# EAGLE design overdriver (EAGLE 7.6.0)
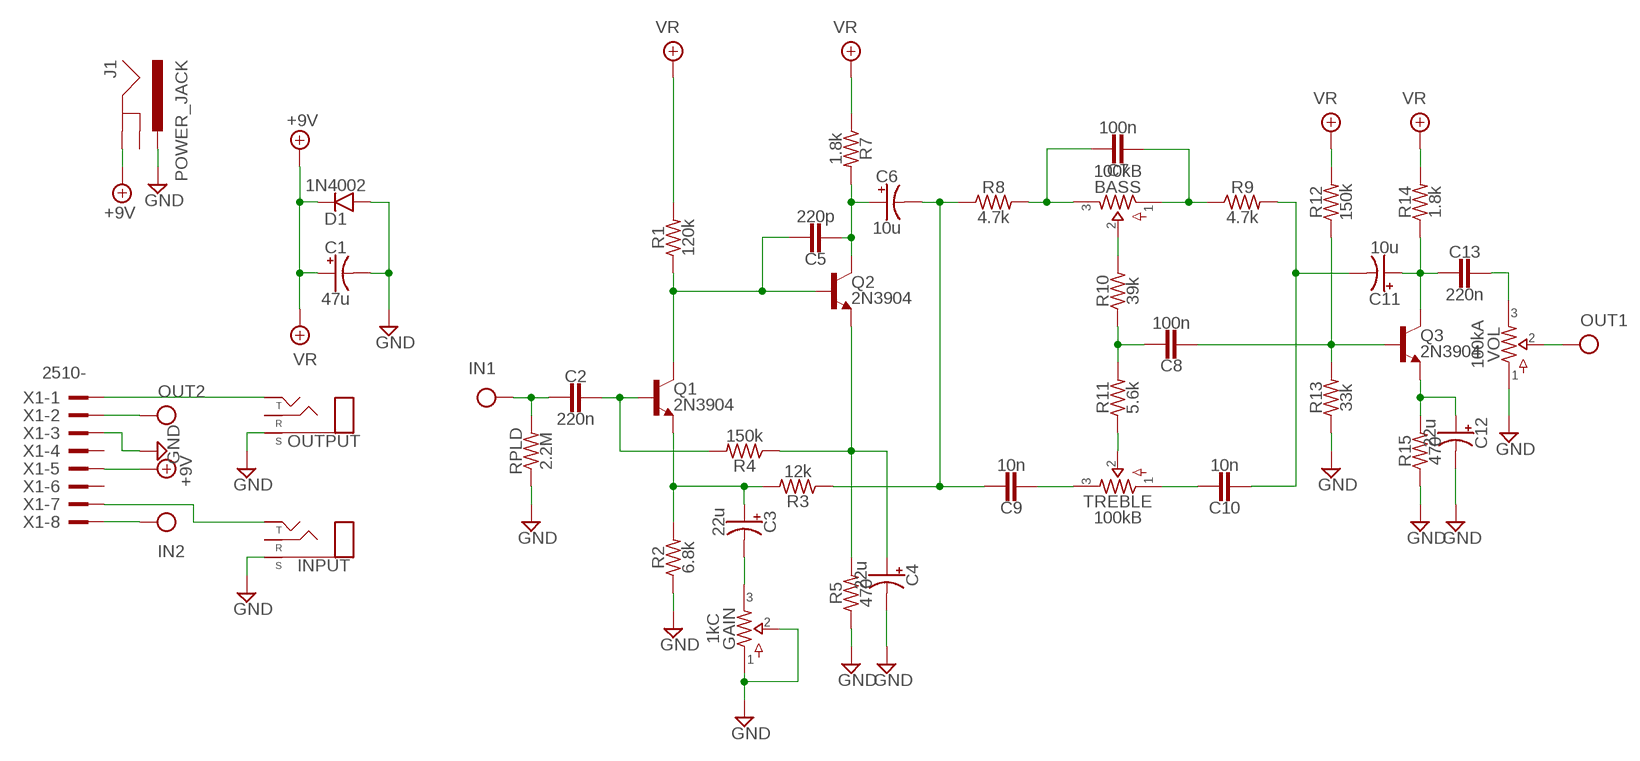
[diagram p0: schematic, sheet 1]

## Parts
BASS  100kB  POTS16MM  [16MM]
C1  47u  0400  [040_020]
C2  220n  CER/FILMBOX.1  [BOX_SMALL]
C3  22u  0400  [040_020]
C4  22u  0400  [040_020]
C5  220p  CER/FILM2  [050X030_025_2]
C6  10u  0501  [050_020_1]
C7  100n  CER/FILMBOX.1  [BOX_SMALL]
C8  100n  CER/FILMBOX.1  [BOX_SMALL]
C9  10n  CER/FILMBOX.1  [BOX_SMALL]
C10  10n  CER/FILMBOX.1  [BOX_SMALL]
C11  10u  0501  [050_020_1]
C12  22u  0400  [040_020]
C13  220n  CER/FILMBOX.1  [BOX_SMALL]
D1  1N4002  DO41.2  [DO41-2]
GAIN  1kC  POTS16MM  [16MM]
INPUT  STEREONMJ  [NMJ6HCD2]
J1  POWER_JACK  [POWER_JACK_PTH]
OUTPUT  STEREONMJ  [NMJ6HCD2]
Q1  2N3904  [TO92-]
Q2  2N3904  [TO92-]
Q3  2N3904  [TO92-]
R1  120k  R_.3B  [R0207/3]
R2  6.8k  R_.3B  [R0207/3]
R3  12k  R_.3B  [R0207/3]
R4  150k  R_.3B  [R0207/3]
R5  470  R_.3B  [R0207/3]
R7  1.8k  R_.3B  [R0207/3]
R8  4.7k  R_.3B  [R0207/3]
R9  4.7k  R_.3B  [R0207/3]
R10  39k  R_.3B  [R0207/3]
R11  5.6k  R_.3B  [R0207/3]
R12  150k  R_.3B  [R0207/3]
R13  33k  R_.3B  [R0207/3]
R14  1.8k  R_.3B  [R0207/3]
R15  470  R_.3B  [R0207/3]
RPLD  2.2M  R_.3B  [R0207/3]
TREBLE  100kB  POTS16MM  [16MM]
VOL  100kA  POTS16MM  [16MM]
X1  2510-  [PAK100/2500-10]

## Nets
+9V: C1.+ D1.C J1.GND X1.5 ; supply symbol labelled VR
GND: C1.- C4.- C12.- D1.A GAIN.1 GAIN.2 INPUT.S J1.PWR OUTPUT.S R2.1 R5.1 R13.1 R15.1 RPLD.1 VOL.1 X1.3
IN: C2.2 RPLD.2 X1.8
N$1: INPUT.T X1.7
N$4: OUTPUT.T X1.1
N$6: C5.1 Q1.1(C) Q2.2(B) R1.1
N$7: C2.1 Q1.2(B) R4.2
N$8: C3.+ Q1.3(E) R2.2 R3.2
N$9: C3.- GAIN.3
N$10: C5.2 C6.+ Q2.1(C) R7.2
N$11: C6.- C9.1 R3.1 R8.1
N$12: C4.+ Q2.3(E) R4.1 R5.2
N$14: BASS.3 C7.1 R8.2
N$15: BASS.1 C7.2 R9.1
N$16: BASS.2 R10.2
N$17: R11.1 TREBLE.2
N$18: C8.1 R10.1 R11.2
N$19: C9.2 TREBLE.3
N$20: C10.1 TREBLE.1
N$21: C10.2 C11.- R9.2
N$22: C8.2 Q3.2(B) R12.1 R13.2
N$23: C11.+ C13.2 Q3.1(C) R14.1
N$24: C12.+ Q3.3(E) R15.2
N$25: C13.1 VOL.3
OUT: VOL.2 X1.2
VR: R1.2 R7.1 R12.2 R14.2
Unconnected: INPUT.R J1.GNDBREAK OUTPUT.R X1.4 X1.6

## Library data of the parts
BASS GAIN TREBLE VOL = pedals-potentiometers:POTS
C1 C3 C4 C12 = pedals-capacitors-elec:040
C2 C5 C7-C10 C13 = pedals-capacitors-film:CER/FILM: 47 - 120pF Xicon Ceramic Disc 2.5mm lead spacing
C6 C11 = pedals-capacitors-elec:050
D1 = pedals-diodes:DO41: DO-41 Package Diodes: 1N4001 - 1N40019 Zener Diodes: 1N4728 - 1N4764
INPUT OUTPUT = pedals-jacks:STEREO
J1 = pedals-jacks:POWER_JACK: Power Jack Connector This is the standard 5.5mm barrel jack for power. The PTH is the most common, proven, reliable, footprint. The Slot footprint only works if the mill layer is transmitted to the PCB fab house so be warned. Here are the connectors we sell at SparkFun: DC Barrel Power Jack/Connector <https://www.sparkfun.com/products/119> (PRT-00119) DC Barrel Power Jack/Connector (SMD) <https://www.sparkfun.com/products/12748> (PRT-12748) DC Barrel Jack Adapter - Breadboard Compatible <https://www.sparkfun.com/products/10811> (PRT-10811) It is used on this SparkFun product (and many, many others): SparkFun RedBoard - Programmed with Arduino <https://www.sparkfun.com/products/12757> (DEV-12757) Also, if you need a mating power supply or connector, please check these out: Wall Adapter Power Supply - 9VDC 650mA <https://www.sparkfun.com/products/298> (TOL-00298) DC Barrel Jack Adapter - Male <https://www.sparkfun.com/products/10287> (PRT-10287); PROD_ID: CONN-08197
Q1-Q3 = pedals-transistors:2N3904: NPN Transistor
R1-R5 R7-R15 RPLD = pedals-resistors:R_
X1 = pedals-headers:2510-: 3M (TM) Pak 100 4-Wall Header Source: 3M; MF: 3M; MPN: 2510-6002UB; OC_FARNELL: 9838244; OC_NEWARK: 46F4725

## Board
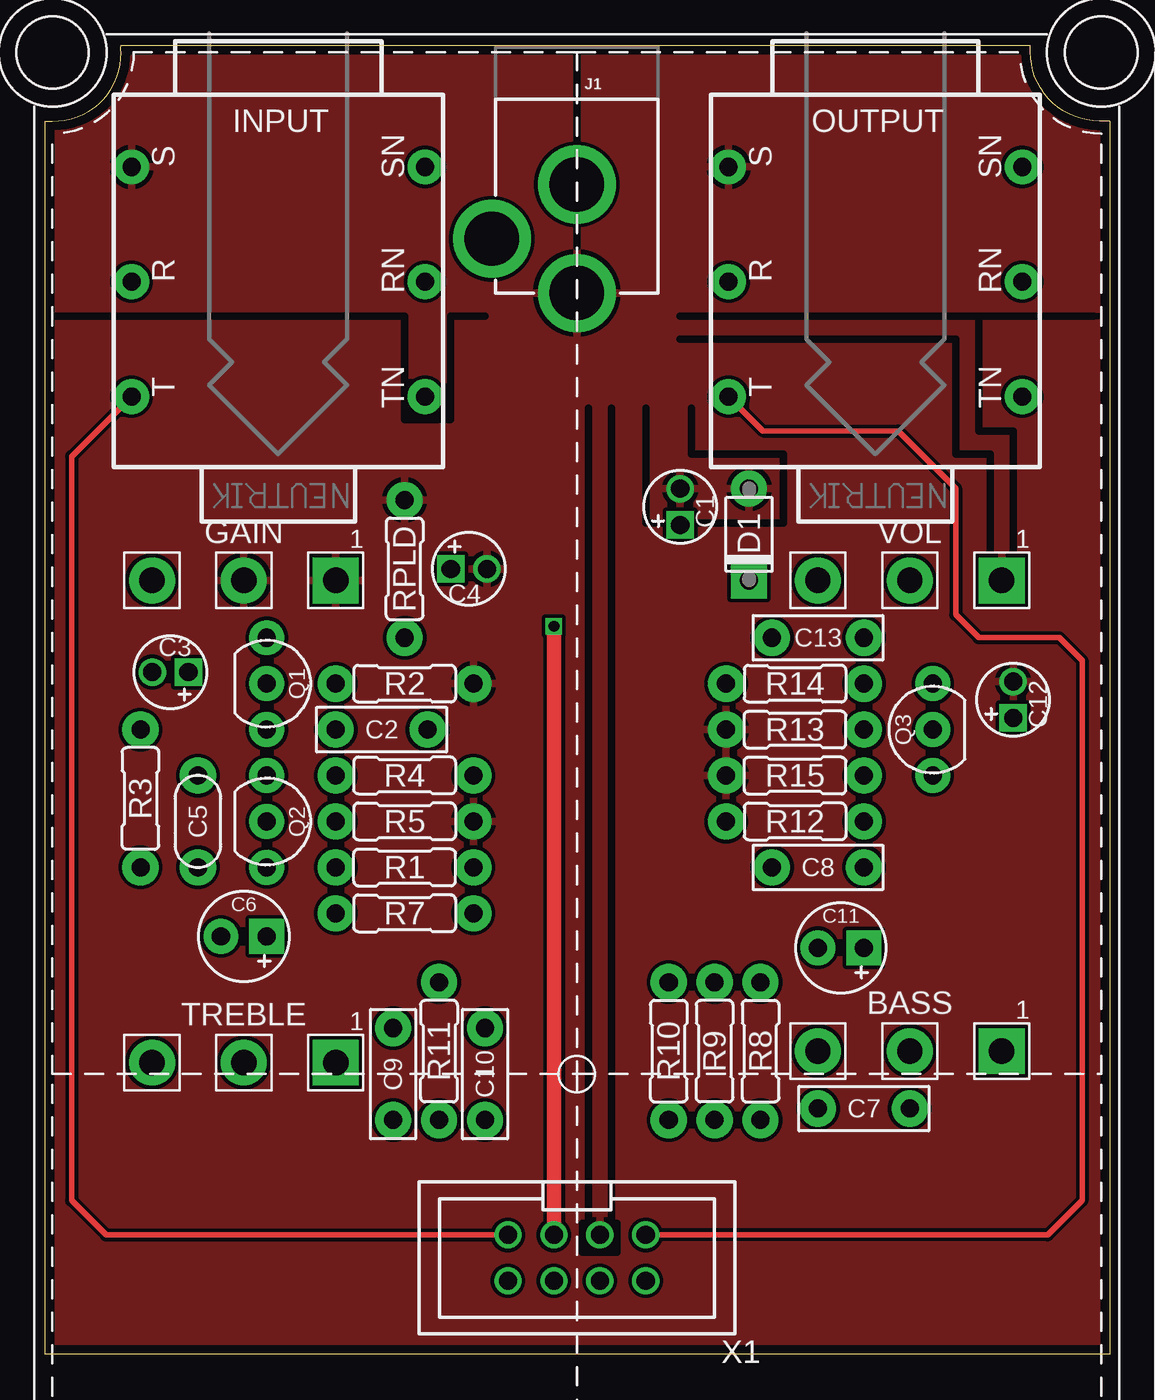
[diagram p1: board, top side]
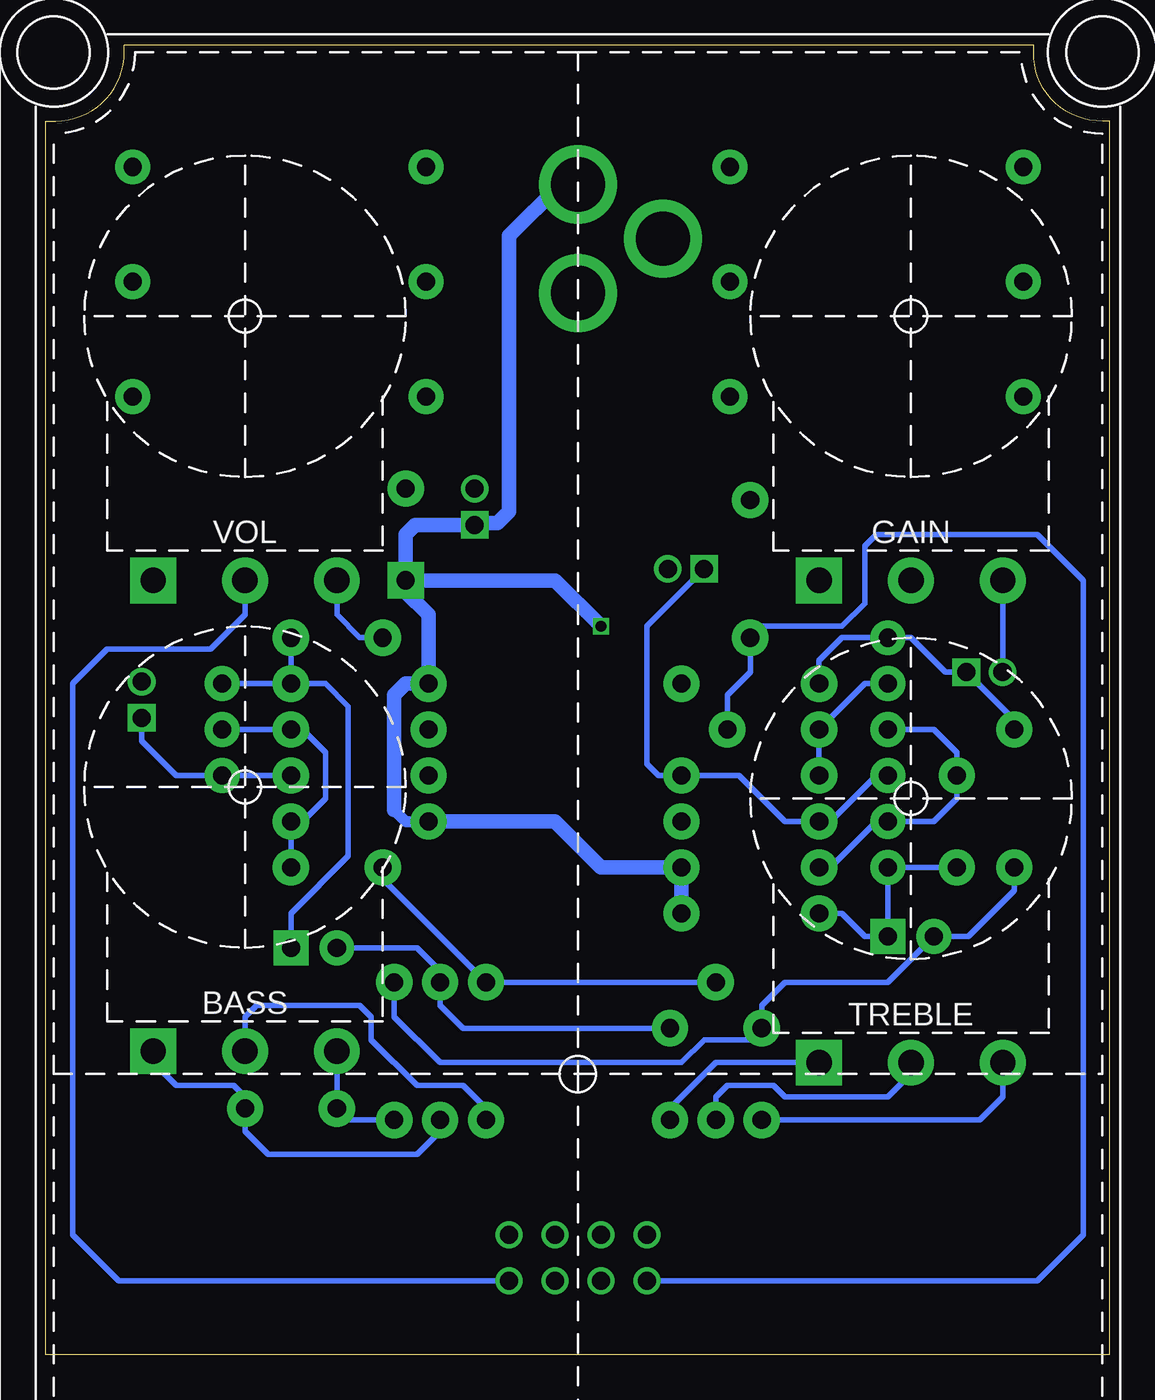
[diagram p2: board, bottom side, seen from below]

Size 58.86 x 72.39 mm. Coordinates in mm from the lower left corner, seen from the top.
Outline: 4.19,72.39 54.48,72.39 54.48,72.01 arc90 58.29,68.2 58.86,68.2 58.86,0 0,0 0,68.2 0.38,68.2 arc93 4.19,72.01 arc-7 4.19,72.39
Copper layers (1*16): Top 0.035mm / dielectric 1.6mm / Bottom 0.035mm
Design rules "Elecrow_2-layer_PCB_eagle_rule": minimum track width 6mil, minimum drill 12mil, track to track 6mil, track to pad 6mil, pad to pad 6mil, via to via 8mil, smd to smd 0mil, copper to edge 20mil, drill to drill 10mil, minimum pad ring 6mil, minimum via ring 6mil, stop-mask expansion 0mil, vias tented up to drill 100mil, thermal gap 10mil
tRestrict: 32 lines

### Footprints (pad centres in the part's own frame; a part is rotated, then mirrored left to right if it is on the bottom)
16MM = drill 1.4 pad 2.54 square: 1 5.08,0 | drill 1.4 pad 2.54: 2 0,0; 3 -5.08,0
040_020 = drill 1 pad 1.524 square: + -1.001,0 | drill 1 pad 1.524: - 1.001,0
BOX_SMALL = drill 1 pad 2: 1 -2.54,0; 2 2.54,0
050X030_025_2 = drill 1 pad 2: 1 -2.54,0; 2 2.54,0
050_020_1 = drill 1 pad 1.93 square: + -1.27,0 | drill 1 pad 1.93: - 1.27,0
DO41-2 = drill 1 pad 2: A 2.54,0 | drill 1 pad 2 square: C -2.54,0
NMJ6HCD2 = drill 1 pad 1.93: R 0,8.115; RN 0,-8.115; S 6.35,8.115; SN 6.35,-8.115; T -6.35,8.115; TN -6.35,-8.115
POWER_JACK_PTH = drill 2.997 pad 4.318: GND 0,7.7; GNDBREAK 4.7,10.7; PWR 0,13.7
TO92- = drill 1 pad 1.93: 1 2.54,0; 2 0,0; 3 -2.54,0
R0207/3 = drill 1 pad 2: 1 -3.81,0; 2 3.81,0
PAK100/2500-10 = drill 1 pad 1.422: 1 -3.81,-1.27; 2 -3.81,1.27; 3 -1.27,-1.27; 4 -1.27,1.27; 5 1.27,-1.27; 6 1.27,1.27; 7 3.81,-1.27; 8 3.81,1.27

### Placement (x,y rotation side)
BASS  47.82,16.76 0 top
C1  35.12,46.86 90 top
C2  18.61,34.54 0 top
C3  6.92,37.72 180 top
C4  23.43,43.43 0 top
C5  8.45,29.46 270 top
C6  10.99,23.11 180 top
C7  45.28,13.59 0 top
C8  42.74,26.92 0 top
C9  19.24,15.49 270 top
C10  24.32,15.49 90 top
C11  44.01,22.48 180 top
C12  53.53,36.2 90 top
C13  42.74,39.62 0 top
D1  38.93,45.34 90 top
GAIN  10.99,42.8 0 top
INPUT  12.89,59.31 90 top
J1  29.4,72.39 180 top
OUTPUT  45.91,59.31 90 top
Q1  12.26,37.08 270 top
Q2  12.26,29.46 270 top
Q3  49.09,34.54 90 top
R1  19.88,26.92 0 top
R2  19.88,37.08 180 top
R3  5.27,30.73 90 top
R4  19.88,32 180 top
R5  19.88,29.46 180 top
R7  19.88,24.38 180 top
R8  39.56,16.76 270 top
R9  37.02,16.76 90 top
R10  34.48,16.76 270 top
R11  21.78,16.76 90 top
R12  41.47,29.46 180 top
R13  41.47,34.54 0 top
R14  41.47,37.08 180 top
R15  41.47,32 0 top
RPLD  19.88,43.43 270 top
TREBLE  10.99,16.13 0 top
U$1  [125B]  29.4,15.49 0 top
VOL  47.82,42.8 0 top
X1  29.4,5.33 180 top

### Tracks (layer width: path | path; a pad name or v marks a point on that pad's centre or on a via)
+9V  (via drill 0.6)
  Top 0.813: v28.13,40.26 X1.5
  Bottom 0.813: J1.GND 30.37,64.69 33.21,61.85 33.21,46.61 33.85,45.97 35,45.97 C1.+ 38.4,45.86 38.93,45.34 D1.C 30.67,42.8 v28.13,40.26
GND
  pour Top (isolate 0.203): 0.19,72.64 59.25,72.64 58.61,0.25 0.19,0.25
IN
  Bottom 0.305: C2.2 21.15,36.45 19.88,37.72 RPLD.2 19.24,40.26 14.8,40.26 13.53,41.53 13.53,44.7 12.89,45.34 4,45.34 1.46,42.8 1.46,6.6 4,4.06 X1.8
N$1
  Top 0.305: INPUT.T 1.46,49.64 1.46,8.51 3.37,6.6 X1.7
N$4
  Top 0.305: OUTPUT.T 39.7,51.05 47.18,51.05 50.36,47.88 50.36,40.89 51.63,39.62 56.07,39.62 57.34,38.35 57.34,8.51 55.44,6.6 X1.1
N$6
  Bottom 0.305: Q1.1 9.72,34.54 8.45,33.27 C5.1 8.45,30.73 9.72,29.46 Q2.2 12.89,29.46 15.43,26.92 R1.1
N$7
  Bottom 0.305: Q1.2 13.53,37.08 C2.1 R4.2
N$8
  Bottom 0.305: R3.2 5.27,35.07 C3.+ 9.08,37.72 10.99,39.62 Q1.3 14.8,39.62 16.07,38.35 R2.2
N$9
  Bottom 0.305: GAIN.3 5.91,37.73 C3.-
N$10
  Bottom 0.305: C5.2 Q2.1 C6.+ 13.53,23.11 14.8,24.38 R7.2
N$11
  Bottom 0.305: R3.1 5.27,25.65 7.81,23.11 C6.- 12.26,20.57 17.97,20.57 19.24,19.3 C9.1 19.88,17.4 22.42,17.4 23.69,16.13 37.02,16.13 39.56,18.67 R8.1
N$12
  Bottom 0.305: Q2.3 12.89,32 15.43,29.46 R5.2 17.97,29.46 20.51,32 R4.1 24.96,32 25.59,32.64 25.59,40.26 22.43,43.42 C4.+
N$14
  Bottom 0.305: R8.2 42.1,12.95 C7.1 BASS.3
N$15
  Bottom 0.305: R9.1 37.02,12.32 38.29,11.05 46.55,11.05 47.82,12.32 C7.2 47.82,14.22 48.45,14.86 51.63,14.86 52.9,16.13 BASS.1
N$16
  Bottom 0.305: R10.2 34.48,13.59 35.75,14.86 38.29,14.86 40.83,17.4 40.83,18.67 41.47,19.3 47.18,19.3 47.82,18.67 BASS.2
N$17
  Bottom 0.305: R11.1 21.78,14.22 21.15,14.86 18.61,14.86 17.97,14.22 12.26,14.22 10.99,15.49 TREBLE.2
N$18
  Bottom 0.305: R11.2 R10.1 40.2,26.29 C8.1
N$19
  Bottom 0.305: TREBLE.3 5.91,14.22 7.18,12.95 C9.2
N$20
  Bottom 0.305: TREBLE.1 21.78,16.13 24.32,13.59 C10.1
N$21
  Bottom 0.305: C10.2 35.75,18.03 37.02,19.3 R9.2 37.02,21.21 38.29,22.48 C11.-
N$22
  Bottom 0.305: Q3.2 R13.2 44.64,34.54 43.37,33.27 43.37,30.73 44.64,29.46 R12.1 C8.2
N$23
  Bottom 0.305: Q3.1 R14.1 | C13.2 R14.1 | C11.+ 45.28,24.38 42.1,27.56 42.1,35.81 43.37,37.08 R14.1
N$24
  Bottom 0.305: R15.2 Q3.3 51.63,32 53.53,33.91 C12.+
N$25
  Bottom 0.305: VOL.3 42.74,40.89 41.47,39.62 C13.1
OUT
  Bottom 0.305: VOL.2 47.82,40.89 49.72,38.99 55.44,38.99 57.34,37.08 57.34,6.6 54.8,4.06 X1.2
VR
  Bottom 0.61: 39.56,30.1 38.93,29.46 R12.2
  Bottom 0.813: R12.2 30.67,29.46 28.13,26.92 R1.2 R7.1 | 38.93,42.16 37.66,40.89 R14.2 38.93,37.08 39.56,36.45 39.56,30.1